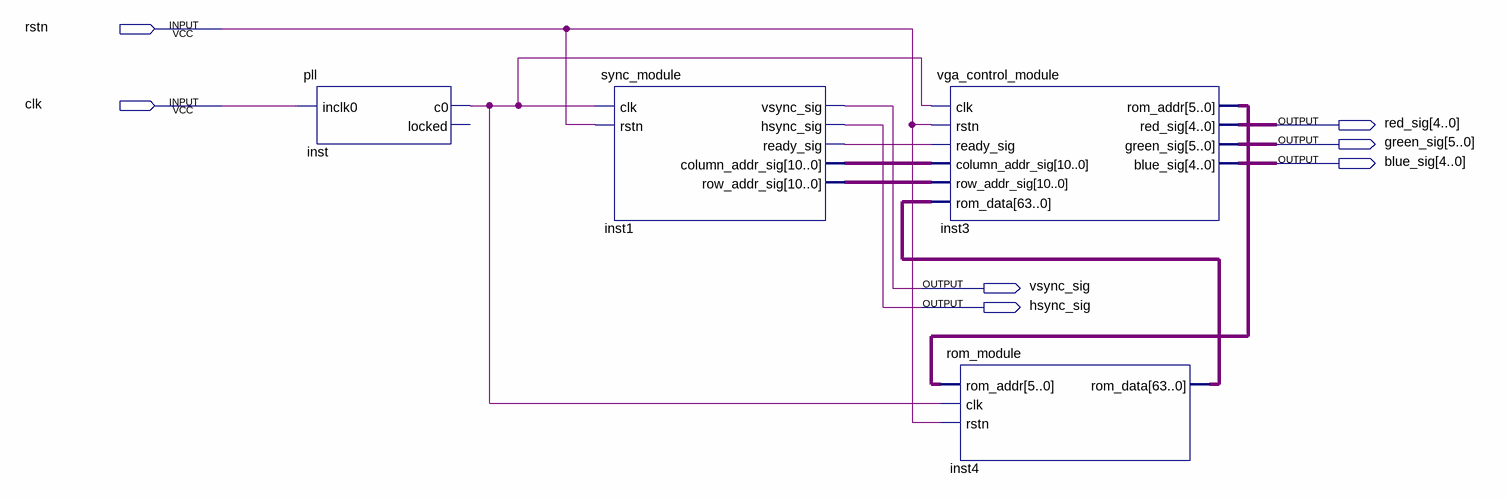
[diagram p0: schematic sheet]
// Quartus schematic vga_test.bdf as structural Verilog: 4 symbols, 7 pins
module vga_test (
  input  rstn,
  input  clk,
  output [4:0] red_sig,
  output [5:0] green_sig,
  output [4:0] blue_sig,
  output vsync_sig,
  output hsync_sig
);

  wire inst1_ready_sig, inst_c0;
  wire [5:0] inst3_rom_addr;
  wire [10:0] inst1_column_addr_sig, inst1_row_addr_sig;
  wire [63:0] inst4_rom_data;

  pll inst (.inclk0(clk), .c0(inst_c0));  // open: locked
  sync_module inst1 (
    .clk(inst_c0), .rstn(rstn), .vsync_sig(vsync_sig), .hsync_sig(hsync_sig), .ready_sig(inst1_ready_sig),
    .column_addr_sig(inst1_column_addr_sig), .row_addr_sig(inst1_row_addr_sig));
  vga_control_module inst3 (
    .clk(inst_c0), .rstn(rstn), .ready_sig(inst1_ready_sig), .column_addr_sig(inst1_column_addr_sig),
    .row_addr_sig(inst1_row_addr_sig), .rom_data(inst4_rom_data), .rom_addr(inst3_rom_addr),
    .red_sig(red_sig), .green_sig(green_sig), .blue_sig(blue_sig));
  rom_module inst4 (.rom_addr(inst3_rom_addr), .clk(inst_c0), .rstn(rstn), .rom_data(inst4_rom_data));
endmodule
